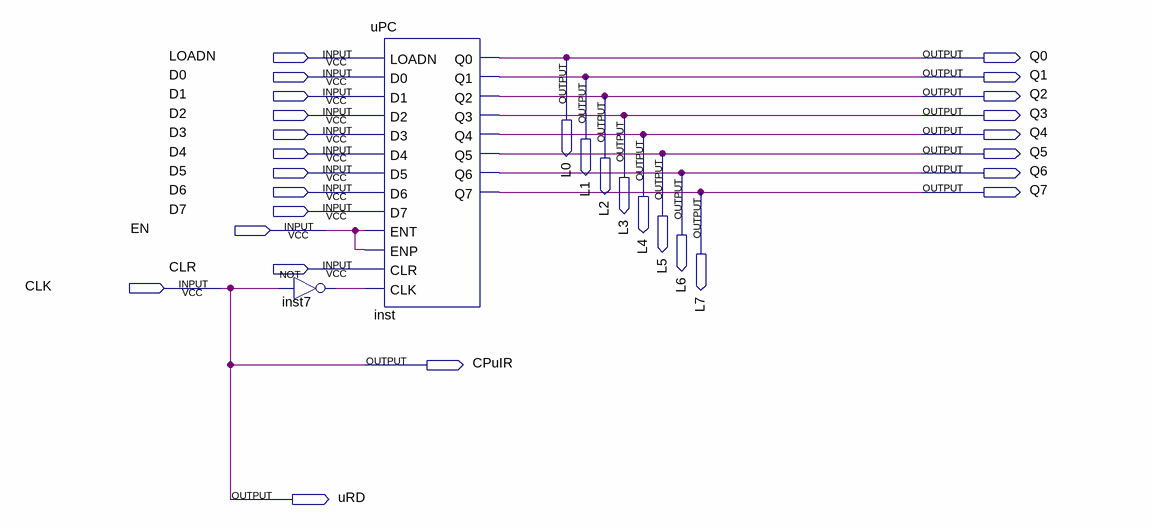
[diagram p0: schematic sheet]
// Quartus schematic COADEXP6.bdf as structural Verilog: 2 symbols, 30 pins
module COADEXP6 (
  input  LOADN,
  input  D0,
  input  D1,
  input  D2,
  input  D3,
  input  D4,
  input  D5,
  input  D6,
  input  D7,
  input  EN,
  input  CLR,
  input  CLK,
  output L0,
  output Q0,
  output L1,
  output Q1,
  output L2,
  output Q2,
  output L3,
  output Q3,
  output L4,
  output Q4,
  output L5,
  output Q5,
  output L6,
  output Q6,
  output L7,
  output Q7,
  output CPuIR,
  output uRD
);

  wire inst7_out;

  not inst7 (inst7_out, CLK);
  uPC inst (
    .LOADN(LOADN), .D0(D0), .D1(D1), .D2(D2), .D3(D3), .D4(D4), .D5(D5), .D6(D6), .D7(D7), .ENT(EN),
    .ENP(EN), .CLR(CLR), .CLK(inst7_out), .Q0(L0), .Q1(L1), .Q2(L2), .Q3(L3), .Q4(L4), .Q5(L5), .Q6(L6),
    .Q7(L7));

  assign CPuIR = CLK;
  assign Q0 = L0;
  assign Q1 = L1;
  assign Q2 = L2;
  assign Q3 = L3;
  assign Q4 = L4;
  assign Q5 = L5;
  assign Q6 = L6;
  assign Q7 = L7;
  assign uRD = CLK;
endmodule
